# Altium schematic sheet relay.SchDoc
size A2
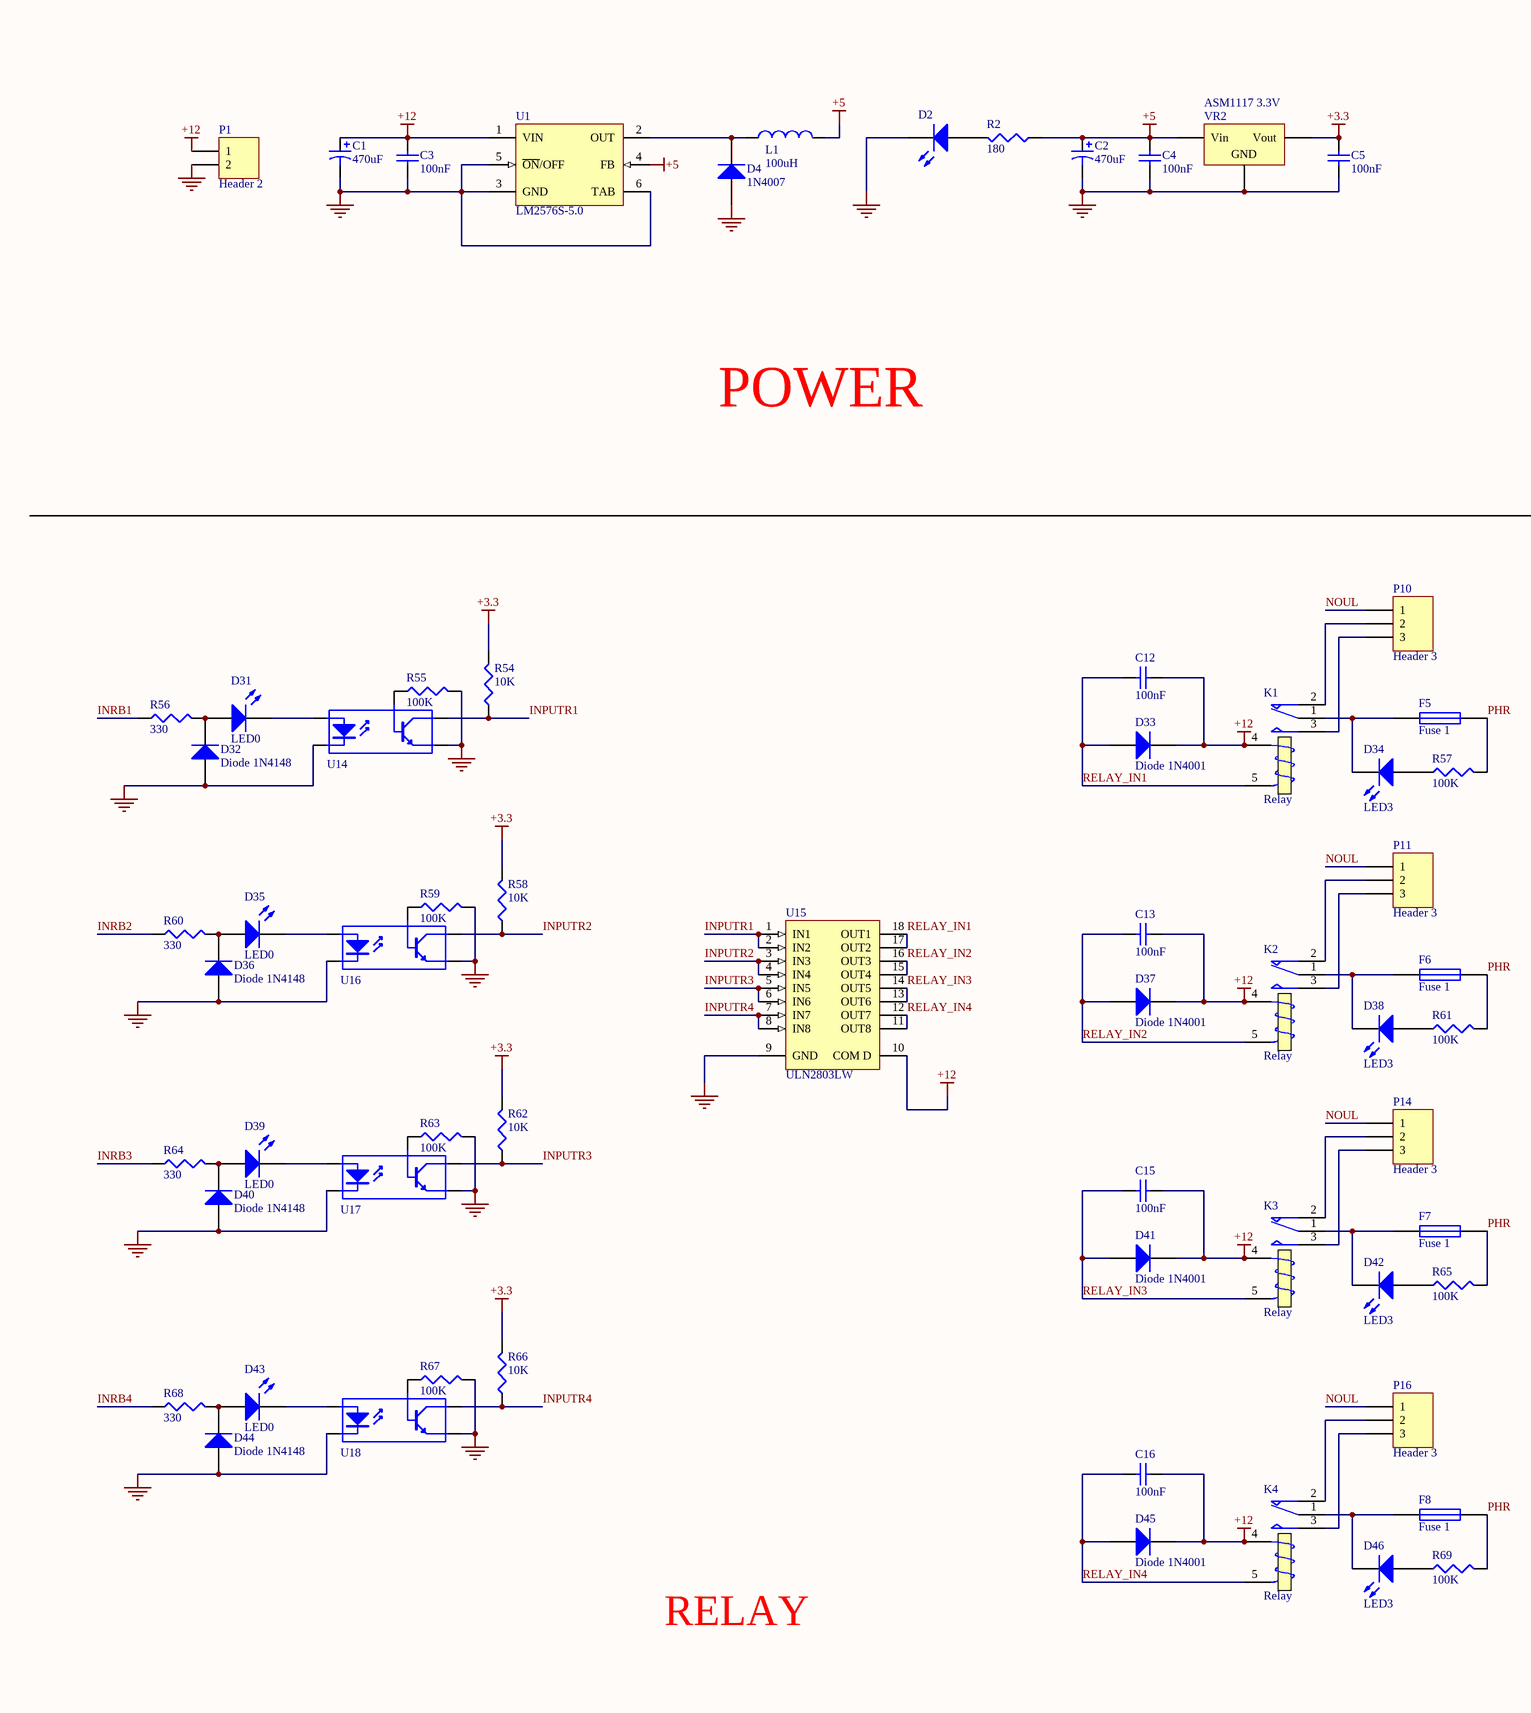
[diagram p0: relay.SchDoc, left]
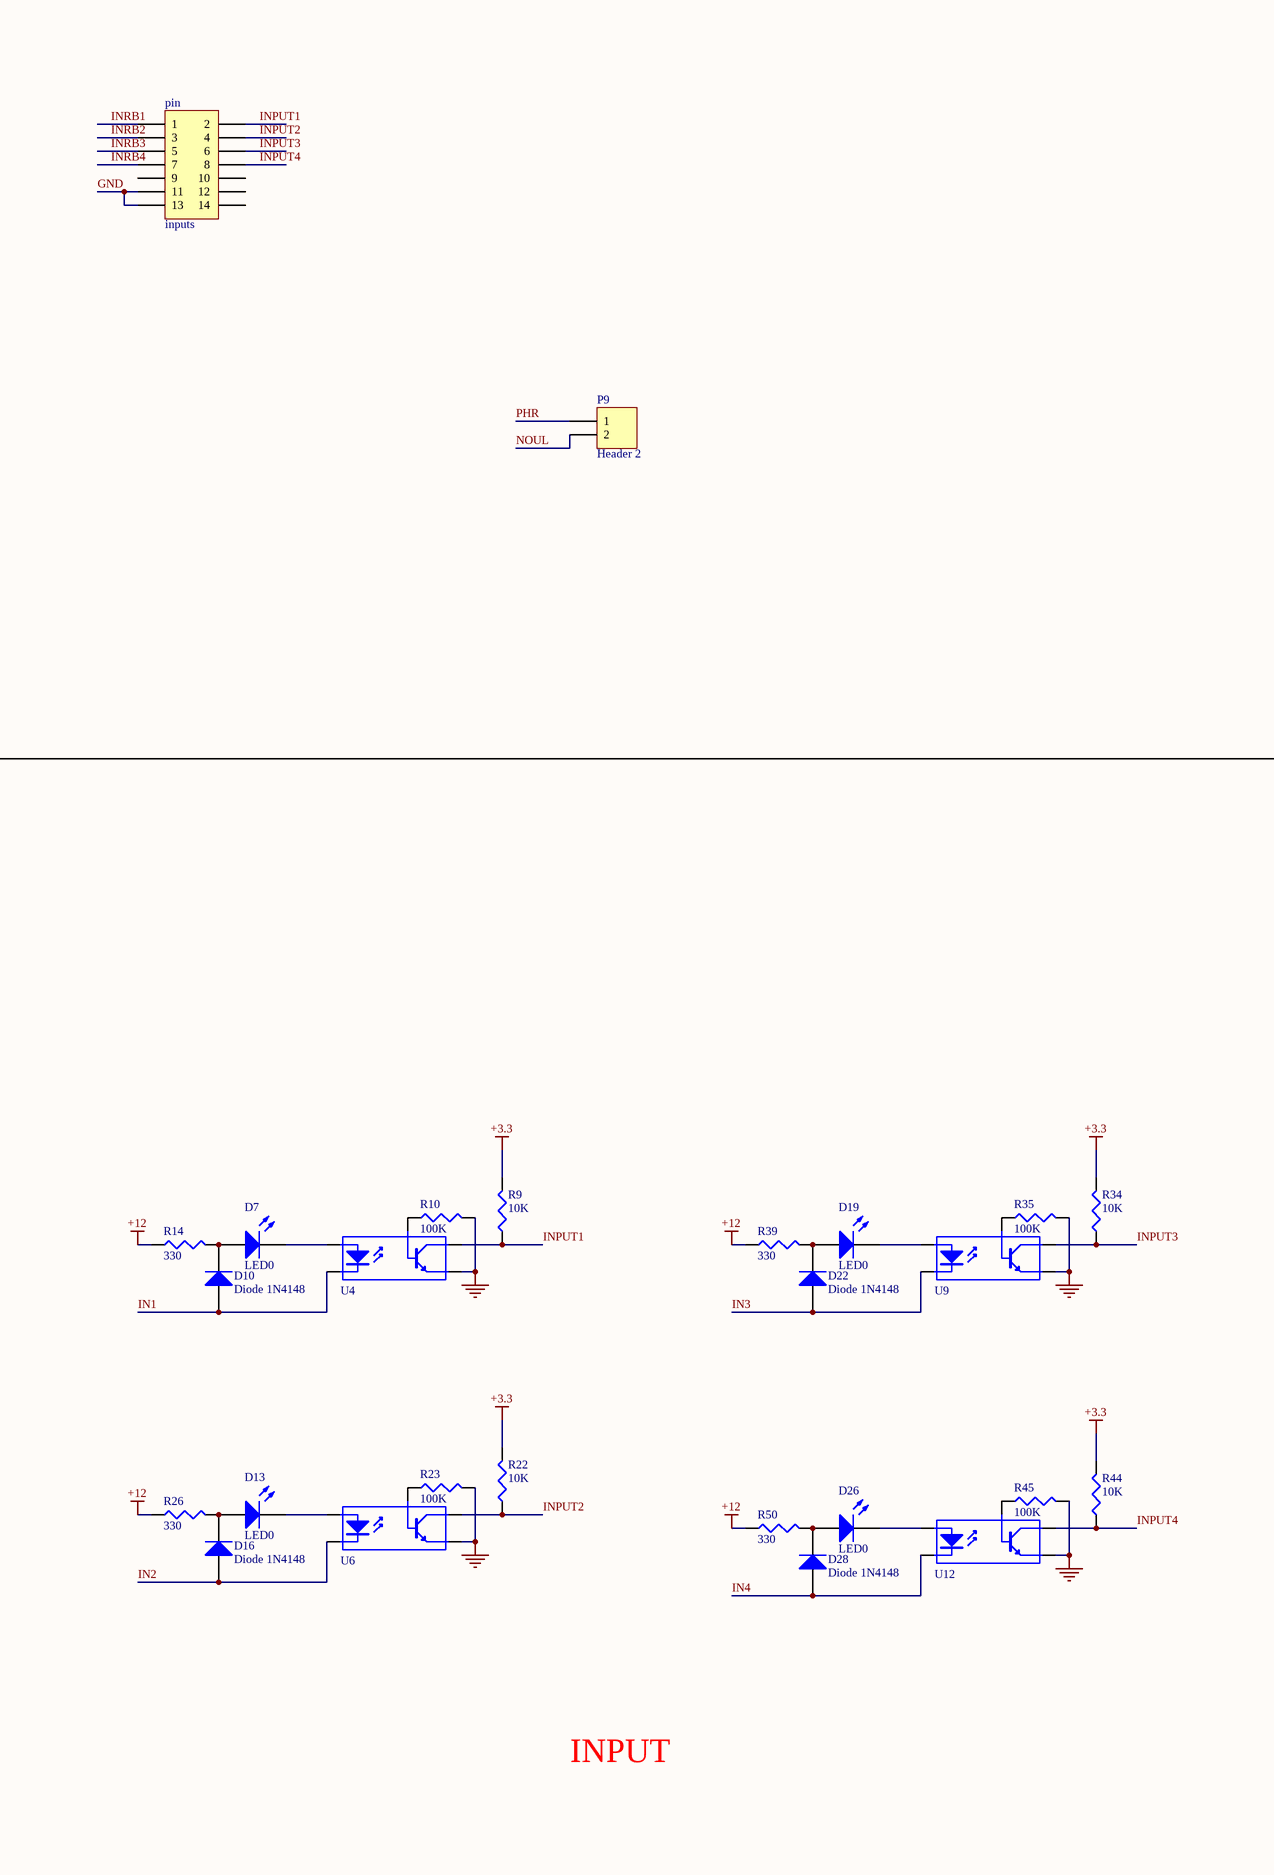
[diagram p1: relay.SchDoc, right]

## Parts
C1  470uF  [CAP470]
C2  470uF  [CAP470]
C3  100nF  [1206]
C4  100nF  [1206]
C5  100nF  [1206]
C12  100nF  [1206]
C13  100nF  [1206]
C15  100nF  [1206]
C16  100nF  [1206]
D2  LED RED  [LED-1206]  (value not drawn)
D4  1N4007  [1N4007]
D7  LED0  [LED-1206]
D10  Diode 1N4148  [Diode]
D13  LED0  [LED-1206]
D16  Diode 1N4148  [Diode]
D19  LED0  [LED-1206]
D22  Diode 1N4148  [Diode]
D26  LED0  [LED-1206]
D28  Diode 1N4148  [Diode]
D31  LED0  [LED-1206]
D32  Diode 1N4148  [Diode]
D33  Diode 1N4001  [1N4007]
D34  LED3  [LED-1206]
D35  LED0  [LED-1206]
D36  Diode 1N4148  [Diode]
D37  Diode 1N4001  [1N4007]
D38  LED3  [LED-1206]
D39  LED0  [LED-1206]
D40  Diode 1N4148  [Diode]
D41  Diode 1N4001  [1N4007]
D42  LED3  [LED-1206]
D43  LED0  [LED-1206]
D44  Diode 1N4148  [Diode]
D45  Diode 1N4001  [1N4007]
D46  LED3  [LED-1206]
F5  Fuse 1  [FUSEXX]
F6  Fuse 1  [FUSEXX]
F7  Fuse 1  [FUSEXX]
F8  Fuse 1  [FUSEXX]
K1  Relay  [RELEY]
K2  Relay  [RELEY]
K3  Relay  [RELEY]
K4  Relay  [RELEY]
L1  100uH  [L-.2/.4]
P1  Header 2  [POWER2_NEW]
P9  Header 2  [POWER2_NEW]
P10  Header 3  [POWER3_NEW]
P11  Header 3  [POWER3_NEW]
P14  Header 3  [POWER3_NEW]
P16  Header 3  [POWER3_NEW]
pin  inputs  [HDR2X7]
R2  value 180  [1206]  (hidden comment: 180R)
R9  10K  [1206]
R10  100K  [1206]
R14  330  [1206]
R22  10K  [1206]
R23  100K  [1206]
R26  330  [1206]
R34  10K  [1206]
R35  100K  [1206]
R39  330  [1206]
R44  10K  [1206]
R45  100K  [1206]
R50  330  [1206]
R54  10K  [1206]
R55  100K  [1206]
R56  330  [1206]
R57  100K  [1206]
R58  10K  [1206]
R59  100K  [1206]
R60  330  [1206]
R61  100K  [1206]
R62  10K  [1206]
R63  100K  [1206]
R64  330  [1206]
R65  100K  [1206]
R66  10K  [1206]
R67  100K  [1206]
R68  330  [1206]
R69  100K  [1206]
U1  LM2576S-5.0  [TS5B_N]
U4  4N29  [Opto]  (value not drawn)
U6  4N29  [Opto]  (value not drawn)
U9  4N29  [Opto]  (value not drawn)
U12  4N29  [Opto]  (value not drawn)
U14  4N29  [Opto]  (value not drawn)
U15  ULN2803LW  [LW18_N]
U16  4N29  [Opto]  (value not drawn)
U17  4N29  [Opto]  (value not drawn)
U18  4N29  [Opto]  (value not drawn)
VR2  ASM1117 3.3V  [Regolator]

## Nets
+3.3: C5.2 R9.2 R22.2 R34.2 R44.2 R54.2 R58.2 R62.2 R66.2 VR2.4(Vout)
+5: C2.1 C4.2 L1.2 R2.1 U1.4(FB) VR2.3(Vin)
+12: C1.1 C3.2 C12.2 C13.2 C15.2 C16.2 D33.2(K) D37.2(K) D41.2(K) D45.2(K) K1.4(T1) K2.4(T1) K3.4(T1) K4.4(T1) P1.1 R14.1 R26.1 R39.1 R50.1 U1.1(VIN) U15.10(COM_D)
GND: C1.2 C2.2 C3.1 C4.1 C5.1 D2.2(K) D4.1(A) D32.1(A) D36.1(A) D40.1(A) D44.1(A) P1.2 pin.11 pin.13 R10.2 R23.2 R35.2 R45.2 R55.2 R59.2 R63.2 R67.2 U1.3(GND) U1.5(~{ON}/OFF) U1.6(TAB) U4.4(E) U6.4(E) U9.4(E) U12.4(E) U14.3(K) U14.4(E) U15.9(GND) U16.3(K) U16.4(E) U17.3(K) U17.4(E) U18.3(K) U18.4(E) VR2.1(GND)
IN1: D10.1(A) U4.3(K)
IN2: D16.1(A) U6.3(K)
IN3: D22.1(A) U9.3(K)
IN4: D28.1(A) U12.3(K)
INPUT1: pin.2 R9.1 U4.5(C)
INPUT2: pin.4 R22.1 U6.5(C)
INPUT3: pin.6 R34.1 U9.5(C)
INPUT4: pin.8 R44.1 U12.5(C)
INPUTR1: R54.1 U14.5(C) U15.1(IN1) U15.2(IN2)
INPUTR2: R58.1 U15.3(IN3) U15.4(IN4) U16.5(C)
INPUTR3: R62.1 U15.5(IN5) U15.6(IN6) U17.5(C)
INPUTR4: R66.1 U15.7(IN7) U15.8(IN8) U18.5(C)
INRB1: pin.1 R56.1
INRB2: pin.3 R60.1
INRB3: pin.5 R64.1
INRB4: pin.7 R68.1
NOUL: P9.2 P10.1 P11.1 P14.1 P16.1
PHR: F5.2 F6.2 F7.2 F8.2 P9.1 R57.2 R61.2 R65.2 R69.2
RELAY_IN1: C12.1 D33.1(A) K1.5(T2) U15.17(OUT2) U15.18(OUT1)
RELAY_IN2: C13.1 D37.1(A) K2.5(T2) U15.15(OUT4) U15.16(OUT3)
RELAY_IN3: C15.1 D41.1(A) K3.5(T2) U15.13(OUT6) U15.14(OUT5)
RELAY_IN4: C16.1 D45.1(A) K4.5(T2) U15.11(OUT8) U15.12(OUT7)
NetD2_1: D2.1(A) R2.2
NetD4_2: D4.2(K) L1.1 U1.2(OUT)
NetD7_1: D7.1(A) D10.2(K) R14.2
NetD7_2: D7.2(K) U4.1(A)
NetD13_1: D13.1(A) D16.2(K) R26.2
NetD13_2: D13.2(K) U6.1(A)
NetD19_1: D19.1(A) D22.2(K) R39.2
NetD19_2: D19.2(K) U9.1(A)
NetD26_1: D26.1(A) D28.2(K) R50.2
NetD26_2: D26.2(K) U12.1(A)
NetD31_1: D31.1(A) D32.2(K) R56.2
NetD31_2: D31.2(K) U14.1(A)
NetD34_1: D34.1(A) R57.1
NetD34_2: D34.2(K) F5.1 K1.1(COM)
NetD35_1: D35.1(A) D36.2(K) R60.2
NetD35_2: D35.2(K) U16.1(A)
NetD38_1: D38.1(A) R61.1
NetD38_2: D38.2(K) F6.1 K2.1(COM)
NetD39_1: D39.1(A) D40.2(K) R64.2
NetD39_2: D39.2(K) U17.1(A)
NetD42_1: D42.1(A) R65.1
NetD42_2: D42.2(K) F7.1 K3.1(COM)
NetD43_1: D43.1(A) D44.2(K) R68.2
NetD43_2: D43.2(K) U18.1(A)
NetD46_1: D46.1(A) R69.1
NetD46_2: D46.2(K) F8.1 K4.1(COM)
NetK1_2: K1.2(NC) P10.2
NetK1_3: K1.3(NO) P10.3
NetK2_2: K2.2(NC) P11.2
NetK2_3: K2.3(NO) P11.3
NetK3_2: K3.2(NC) P14.2
NetK3_3: K3.3(NO) P14.3
NetK4_2: K4.2(NC) P16.2
NetK4_3: K4.3(NO) P16.3
NetR10_1: R10.1 U4.6(B)
NetR23_1: R23.1 U6.6(B)
NetR35_1: R35.1 U9.6(B)
NetR45_1: R45.1 U12.6(B)
NetR55_1: R55.1 U14.6(B)
NetR59_1: R59.1 U16.6(B)
NetR63_1: R63.1 U17.6(B)
NetR67_1: R67.1 U18.6(B)

Not connected (* = marked no-connect by the designer): pin 9 10 12 14

## Notes on the sheet
- POWER
- INPUT
- RELAY

## Library data of the parts
C1 C2 = Cap Pol1: Polarized Capacitor (Radial); Published: 8-Jun-2000; LatestRevisionDate: 17-Jul-2002; LatestRevisionNote: Re-released for DXP Platform.; PackageReference: RB7.6-15; Publisher: Altium Limited; Value: 470uF
C3-C5 C12 C13 C15 C16 = Cap Semi: Capacitor (Semiconductor SIM Model); Published: 8-Jun-2000; LatestRevisionDate: 29-May-2009; LatestRevisionNote: IPC-7351 Footprint Added.; PackageReference: C1206; Publisher: Altium Limited; PackageDescription: Chip Capacitor; Value: 100nF
D2 D7 D13 D19 D26 D31 D35 D39 D43 = LED0: Typical INFRARED GaAs LED; Published: 8-Jun-2000; LatestRevisionDate: 08-Jul-2005; LatestRevisionNote: Mech Layer 1 removed.; PackageReference: LED-0; Publisher: Altium Limited
D4 = Diode 1N4007: 1 Amp General Purpose Rectifier; Published: 8-Jun-2000; LatestRevisionDate: 17-Jul-2002; LatestRevisionNote: Re-released for DXP Platform.; DatasheetVersion: 1998; PackageVersion: Aug-1999; PackageReference: DO-41; Publisher: Altium Limited; PackageDescription: Diode, Axial; Body 5.2 x 2.7 mm (LxDia. max), Lead Dia. 0.86 mm (max); Code_JEDEC: DO-204-AL; ComponentLink1Description: Manufacturer Link; ComponentLink1URL: http://www.fairchildsemi.com/; ComponentLink2Description: Datasheet; ComponentLink2URL: http://www.fairchildsemi.com/ds/1N%2F1N4001.pdf
D10 D16 D22 D28 D32 D36 D40 D44 = Diode 1N4148: High Conductance Fast Diode; Published: 8-Jun-2000; LatestRevisionDate: 17-Jul-2002; LatestRevisionNote: Re-released for DXP Platform.; DatasheetVersion: 1997; PackageReference: DO-35; Publisher: Altium Limited; Code_JEDEC: DO-204-AH; ComponentLink1Description: Manufacturer Link; ComponentLink1URL: http://www.fairchildsemi.com/; ComponentLink2Description: Datasheet; ComponentLink2URL: http://www.fairchildsemi.com/ds/1N%2F1N4148.pdf
D33 D37 D41 D45 = Diode 1N4001: 1 Amp General Purpose Rectifier; Published: 8-Jun-2000; LatestRevisionDate: 17-Jul-2002; LatestRevisionNote: Re-released for DXP Platform.; DatasheetVersion: 1998; PackageVersion: Aug-1999; PackageReference: DO-41; Publisher: Altium Limited; PackageDescription: Diode, Axial; Body 5.2 x 2.7 mm (LxDia. max), Lead Dia. 0.86 mm (max); Code_JEDEC: DO-204-AL; ComponentLink1Description: Manufacturer Link; ComponentLink1URL: http://www.fairchildsemi.com/; ComponentLink2Description: Datasheet; ComponentLink2URL: http://www.fairchildsemi.com/ds/1N%2F1N4001.pdf
D34 D38 D42 D46 = LED3: Typical BLUE SiC LED; Published: 8-Jun-2000; LatestRevisionDate: 17-Dec-2003; LatestRevisionNote: PCB Footprint replaced.; DatasheetVersion: 16-Apr-2002; PackageVersion: 16-Apr-2002; PackageReference: 3.5X2.8X1.9; Publisher: Altium Limited; PackageDescription: SM LED; 2 C-Bend Leads; Body 3.5 x 2.8 x 1.9 mm, inc leads (LxWxH typ)
F5-F8 = Fuse 1: Fuse; Published: 8-Jun-2000; LatestRevisionDate: 17-Jul-2002; LatestRevisionNote: Re-released for DXP Platform.; PackageReference: PIN-W2/E2.8; Publisher: Altium Limited; PackageDescription: Thru-Hole; 2 Leads
K1-K4 = Relay: SPDT Relay; Published: 8-Jun-2000; LatestRevisionDate: 17-Jul-2002; LatestRevisionNote: Re-released for DXP Platform.; PackageReference: MODULE5B; Publisher: Altium Limited
L1 = INDUCTOR
P1 P9 = Header 2: Header, 2-Pin; LatestRevisionDate: 17-Jul-2002; LatestRevisionNote: Re-released for DXP Platform.; Publisher: Altium Limited
P10 P11 P14 P16 = Header 3: Header, 3-Pin; LatestRevisionDate: 17-Jul-2002; LatestRevisionNote: Re-released for DXP Platform.; Publisher: Altium Limited
pin = Header 7X2: Header, 7-Pin, Dual row; LatestRevisionDate: 17-Jul-2002; LatestRevisionNote: Re-released for DXP Platform.; Publisher: Altium Limited
R2 R9 R10 R14 R22 R23 R26 R34 R35 R39 R44 R45 R50 R54-R56 R58-R60 R62-R64 R66-R68 = Res3: Resistor; Published: 8-Jun-2000; LatestRevisionDate: 29-May-2009; LatestRevisionNote: IPC-7351 Footprint Added.; PackageReference: J1-0603; Publisher: Altium Limited; PackageDescription: Chip Resistor
  R9 R22 R34 R44 R54 R58 R62 R66: Value: 10K
  R10 R23 R35 R45 R55 R59 R63 R67: Value: 100K
  R14 R26 R39 R50 R56 R60 R64 R68: Value: 330
R57 R61 R65 R69 = Res3: Resistor; Value: 330; Published: 8-Jun-2000; LatestRevisionDate: 29-May-2009; LatestRevisionNote: IPC-7351 Footprint Added.; PackageReference: J1-0603; Publisher: Altium Limited; PackageDescription: Chip Resistor
U1 = LM2576S-5.0: SIMPLE SWITCHER; 3A Step-Down Voltage Regulator; Manufacturer: National Semiconductor; PackageTopMarking: NSUZXYTT*LM2576S*-5.0 P+; PowerWise: N; Published: 4-Dec-2008; DatasheetVersion: Aug-2004; PackageVersion: revD, Apr-2005; PackageReference: TS5B; Publisher: Altium Limited; PackageDescription: TO-263, Molded, .400 x .390 x .180in, 5 Lead, .067in Pitch, Surface Mount; CompType: Switcher; PartNumber: LM2576S-5.0; RoHS: O; PinCount: 5; DigiKeyPartNumber: LM2576S-5.0-ND; Code_JEDEC: MO-169-AB; ComponentLink1Description: LM2576 Datasheet
U4 U6 U9 U12 U14 U16-U18 = 4N29: 5 Pin Mini Flat Pack Optocoupler; Published: 24-Mar-1999; LatestRevisionDate: 04-Mar-2005; LatestRevisionNote: PCB Footprint replaced, Sch pins re-numbered.; DatasheetVersion: Apr-2004; PackageReference: SOP5(6); Publisher: Altium Limited
U15 = ULN2803LW: High-Voltage, High-Current Darlington Array; Published: 13-Oct-2000; LatestRevisionDate: 13-Apr-2006; LatestRevisionNote: IPC-7351 Footprint Added.; DatasheetVersion: 1999; PackageReference: LW18; Publisher: Altium Limited; PackageDescription: 18-Pin Small Outline Integrated Circuit 1.27 mm Pitch; Code_JEDEC: MS-013-AB; ComponentLink1Description: Manufacturer Link; ComponentLink1URL: http://www.allegromicro.com/
VR2 = Volt Reg_1: Voltage Regulator; Published: 24-Mar-1999; LatestRevisionDate: 29-May-2009; LatestRevisionNote: IPC-7351 Footprint Added.; PackageReference: D2PAK; Publisher: Altium Limited; PackageDescription: 3-Pin Transistor Outline Package 2.54 mm Pitch, 15.1 mm Lead Span